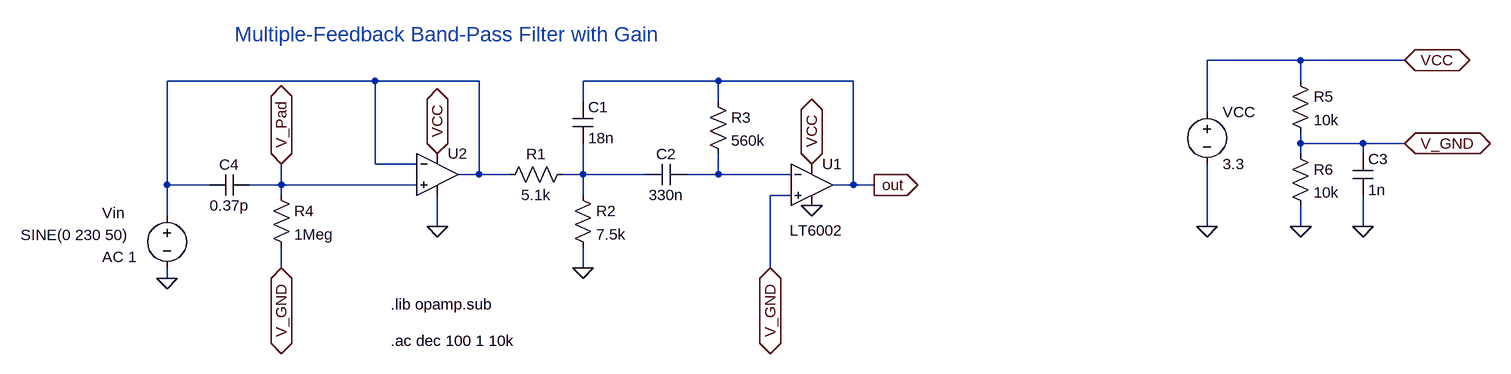
[diagram p0: schematic MF_bandpass.asc]
MF_bandpass.asc, the LTspice schematic file:
Version 4
SHEET 1 1452 680
WIRE 1152 -272 1008 -272
WIRE 1312 -272 1152 -272
WIRE -272 -240 -592 -240
WIRE -112 -240 -272 -240
WIRE 256 -240 48 -240
WIRE 464 -240 256 -240
WIRE 1152 -240 1152 -272
WIRE 48 -208 48 -240
WIRE 256 -208 256 -240
WIRE 1008 -192 1008 -272
WIRE 1152 -144 1152 -160
WIRE 1248 -144 1152 -144
WIRE 1312 -144 1248 -144
WIRE 1152 -128 1152 -144
WIRE 1248 -128 1248 -144
WIRE -272 -112 -272 -240
WIRE -208 -112 -272 -112
WIRE -112 -96 -112 -240
WIRE -112 -96 -144 -96
WIRE -64 -96 -112 -96
WIRE 48 -96 48 -144
WIRE 48 -96 16 -96
WIRE 144 -96 48 -96
WIRE 256 -96 256 -128
WIRE 256 -96 208 -96
WIRE 368 -96 256 -96
WIRE -592 -80 -592 -240
WIRE -528 -80 -592 -80
WIRE -416 -80 -416 -112
WIRE -416 -80 -464 -80
WIRE -208 -80 -416 -80
WIRE 464 -80 464 -240
WIRE 464 -80 432 -80
WIRE 496 -80 464 -80
WIRE -416 -64 -416 -80
WIRE 48 -64 48 -96
WIRE 368 -64 336 -64
WIRE -592 -32 -592 -80
WIRE -176 -16 -176 -64
WIRE 1008 -16 1008 -112
WIRE 1152 -16 1152 -48
WIRE 1248 -16 1248 -64
WIRE -416 48 -416 16
WIRE 48 48 48 16
WIRE 336 48 336 -64
WIRE -592 64 -592 48
FLAG -592 64 0
FLAG 496 -80 out
IOPIN 496 -80 Out
FLAG 48 48 0
FLAG 400 -48 0
FLAG 1008 -16 0
FLAG -176 -16 0
FLAG 1152 -16 0
FLAG 1248 -16 0
FLAG 1312 -272 VCC
IOPIN 1312 -272 BiDir
FLAG 1312 -144 V_GND
IOPIN 1312 -144 BiDir
FLAG 336 48 V_GND
IOPIN 336 48 BiDir
FLAG 400 -112 VCC
IOPIN 400 -112 BiDir
FLAG -176 -128 VCC
IOPIN -176 -128 BiDir
FLAG -416 48 V_GND
IOPIN -416 48 BiDir
FLAG -416 -112 V_Pad
IOPIN -416 -112 BiDir
SYMBOL voltage -592 -48 R0
WINDOW 123 -100 79 Left 2
WINDOW 39 0 0 Left 0
WINDOW 0 -100 11 Left 2
WINDOW 3 -225 45 Left 2
SYMATTR Value2 AC 1
SYMATTR InstName Vin
SYMATTR Value SINE(0 230 50)
SYMBOL res 32 -112 R90
WINDOW 0 0 56 VBottom 2
WINDOW 3 32 56 VTop 2
SYMATTR InstName R1
SYMATTR Value 5.1k
SYMBOL res -432 -80 R0
SYMATTR InstName R4
SYMATTR Value 1Meg
SYMBOL cap -464 -96 R90
WINDOW 0 0 32 VBottom 2
WINDOW 3 32 32 VTop 2
SYMATTR InstName C4
SYMATTR Value 0.37p
SYMBOL Opamps\\LT6002 400 -80 R0
WINDOW 3 -34 70 Left 2
SYMATTR InstName U1
SYMBOL voltage 1008 -208 R0
WINDOW 123 24 124 Left 2
WINDOW 39 0 0 Left 0
SYMATTR InstName VCC
SYMATTR Value 3.3
SYMBOL res 32 -80 R0
SYMATTR InstName R2
SYMATTR Value 7.5k
SYMBOL res 240 -224 R0
SYMATTR InstName R3
SYMATTR Value 560k
SYMBOL cap 32 -208 R0
SYMATTR InstName C1
SYMATTR Value 18n
SYMBOL cap 208 -112 R90
WINDOW 0 0 32 VBottom 2
WINDOW 3 32 32 VTop 2
SYMATTR InstName C2
SYMATTR Value 330n
SYMBOL res 1136 -256 R0
SYMATTR InstName R5
SYMATTR Value 10k
SYMBOL res 1136 -144 R0
SYMATTR InstName R6
SYMATTR Value 10k
SYMBOL cap 1232 -128 R0
SYMATTR InstName C3
SYMATTR Value 1n
SYMBOL Opamps\\UniversalOpamp2 -176 -96 R0
SYMATTR InstName U2
TEXT -248 104 Left 2 !.lib opamp.sub
TEXT -248 160 Left 2 !.ac dec 100 1 10k
TEXT -488 -312 Left 3 ;Multiple-Feedback Band-Pass Filter with Gain

The netlist it stands for:
* MF_bandpass.asc
Vin N001 0 SINE(0 230 50) AC 1
R1 N002 N001 5.1k
R4 V_Pad V_GND 1Meg
C4 V_Pad N001 0.37p
* U1: LT6002 (symbol Opamps\LT6002 not available, pins judged from their places): In+=V_GND In-=N003 V+=VCC V-=0 OUT=out
VCC VCC 0 3.3
R2 N002 0 7.5k
R3 out N003 560k
C1 out N002 18n
C2 N003 N002 330n
R5 VCC V_GND 10k
R6 V_GND 0 10k
C3 V_GND 0 1n
XU2 V_Pad N001 VCC 0 N001 level.2 Avol=1Meg GBW=10Meg Slew=10Meg ilimit=25m rail=0 Vos=0 phimargin=45 en=0 enk=0 in=0 ink=0 Rin=500Meg  ; pins IN+ IN- V+ V- OUT
.lib opamp.sub
.ac dec 100 1 10k
* Multiple-Feedback Band-Pass Filter with Gain
.lib UniversalOpamps2.sub
.backanno
.end